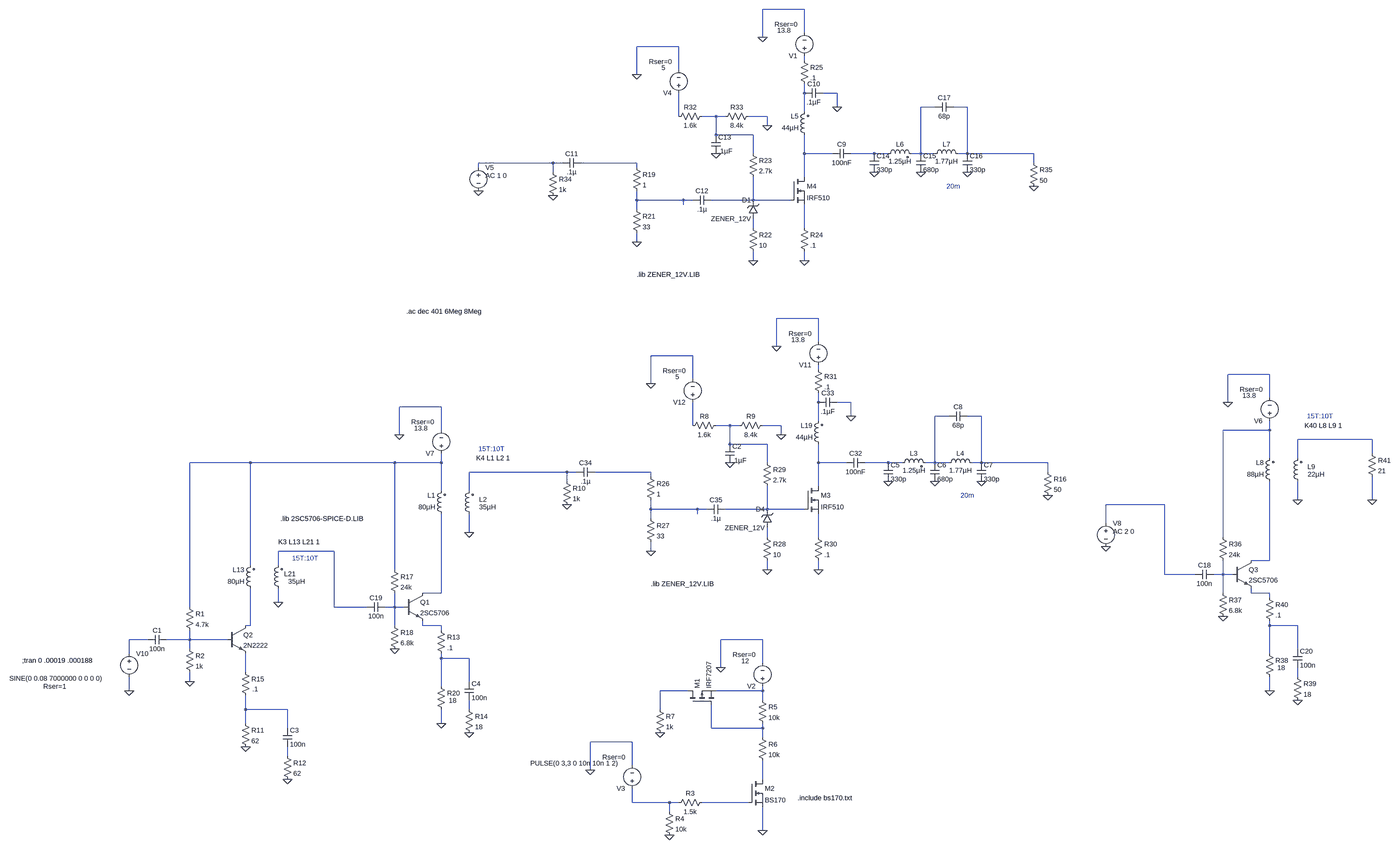
[diagram p0: schematic SSB Amp 7 MHz v2 Impedance.asc, whole sheet]
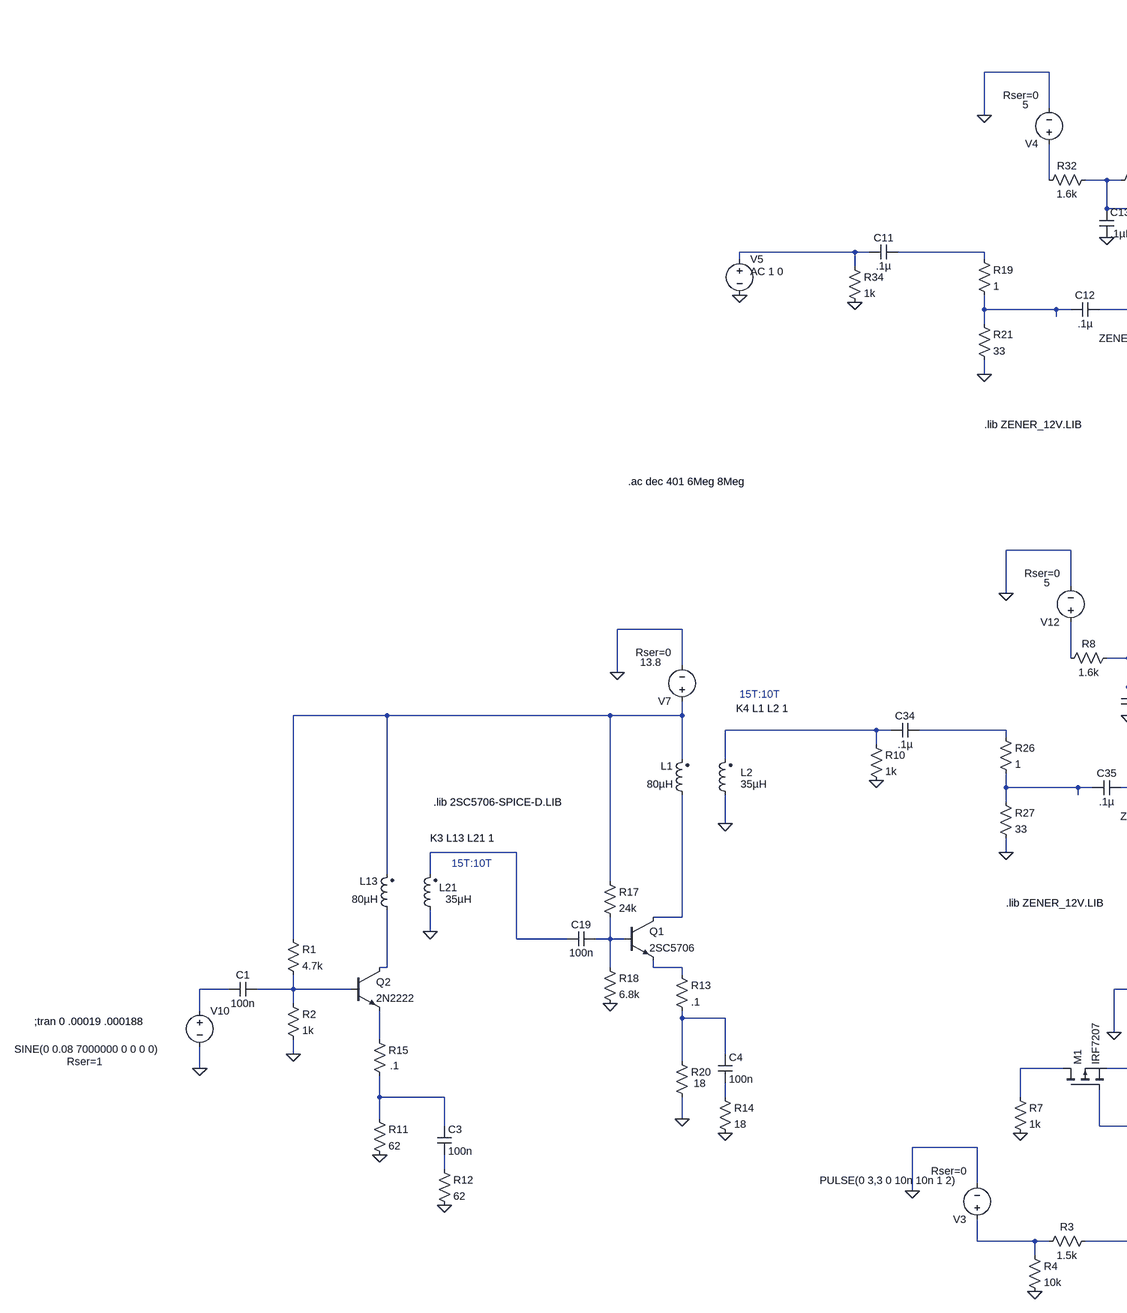
[diagram p1: schematic SSB Amp 7 MHz v2 Impedance.asc, part, row 1 of 1, column 1 of 2]
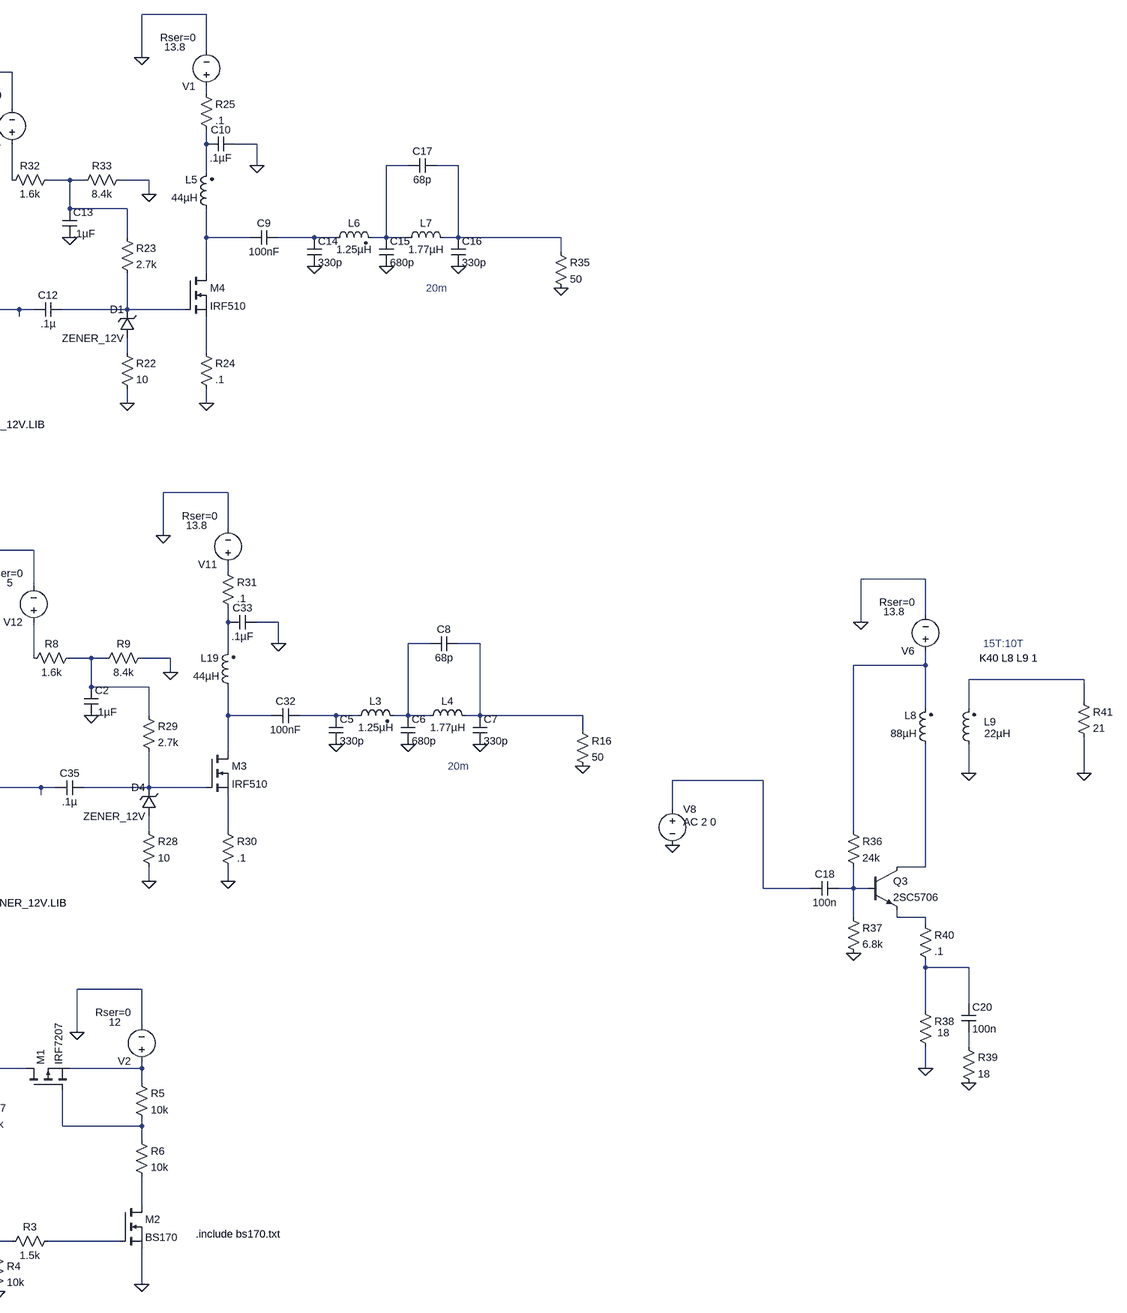
[diagram p2: schematic SSB Amp 7 MHz v2 Impedance.asc, part, row 1 of 1, column 2 of 2]
SSB Amp 7 MHz v2 Impedance.asc, the LTspice schematic file:
Version 4
SHEET 1 3764 1240
WIRE 560 -4608 416 -4608
WIRE 560 -4528 560 -4608
WIRE 416 -4512 416 -4608
WIRE 128 -4480 -16 -4480
WIRE 560 -4432 560 -4448
WIRE 128 -4400 128 -4480
WIRE -16 -4384 -16 -4480
WIRE 560 -4320 560 -4352
WIRE 672 -4320 624 -4320
WIRE 672 -4272 672 -4320
WIRE 1008 -4272 960 -4272
WIRE 1120 -4272 1072 -4272
WIRE 560 -4256 560 -4320
WIRE 128 -4240 128 -4320
WIRE 256 -4240 208 -4240
WIRE 288 -4240 256 -4240
WIRE 432 -4240 368 -4240
WIRE 432 -4208 432 -4240
WIRE 256 -4176 256 -4240
WIRE 384 -4176 256 -4176
WIRE 384 -4112 384 -4176
WIRE 560 -4112 560 -4176
WIRE 656 -4112 560 -4112
WIRE 800 -4112 720 -4112
WIRE 848 -4112 800 -4112
WIRE 960 -4112 960 -4272
WIRE 960 -4112 928 -4112
WIRE 1008 -4112 960 -4112
WIRE 1120 -4112 1120 -4272
WIRE 1120 -4112 1088 -4112
WIRE 1488 -4112 1120 -4112
WIRE -304 -4080 -560 -4080
WIRE -272 -4080 -304 -4080
WIRE -16 -4080 -208 -4080
WIRE 1488 -4080 1488 -4112
WIRE -560 -4064 -560 -4080
WIRE -16 -4064 -16 -4080
WIRE -304 -4048 -304 -4080
WIRE 560 -4032 560 -4112
WIRE -16 -3952 -16 -3984
WIRE 144 -3952 -16 -3952
WIRE 176 -3952 144 -3952
WIRE 384 -3952 384 -4032
WIRE 384 -3952 240 -3952
WIRE 512 -3952 384 -3952
WIRE 144 -3936 144 -3952
WIRE -16 -3920 -16 -3952
WIRE 384 -3856 384 -3888
WIRE 560 -3856 560 -3936
WIRE -16 -3808 -16 -3840
WIRE 384 -3744 384 -3776
WIRE 560 -3744 560 -3776
WIRE 608 -3472 464 -3472
WIRE 608 -3392 608 -3472
WIRE 464 -3376 464 -3472
WIRE 176 -3344 32 -3344
WIRE 608 -3296 608 -3312
WIRE 3200 -3280 3056 -3280
WIRE 176 -3264 176 -3344
WIRE 32 -3248 32 -3344
WIRE 3200 -3200 3200 -3280
WIRE 608 -3184 608 -3216
WIRE 720 -3184 672 -3184
WIRE 3056 -3184 3056 -3280
WIRE -688 -3168 -832 -3168
WIRE 720 -3136 720 -3184
WIRE 1056 -3136 1008 -3136
WIRE 1168 -3136 1120 -3136
WIRE 608 -3120 608 -3184
WIRE 176 -3104 176 -3184
WIRE 304 -3104 256 -3104
WIRE 336 -3104 304 -3104
WIRE 480 -3104 416 -3104
WIRE -688 -3088 -688 -3168
WIRE 3200 -3088 3200 -3120
WIRE 3200 -3088 3040 -3088
WIRE -832 -3072 -832 -3168
WIRE 480 -3072 480 -3104
WIRE 3552 -3056 3296 -3056
WIRE 304 -3040 304 -3104
WIRE 432 -3040 304 -3040
WIRE 3552 -3008 3552 -3056
WIRE 3200 -2992 3200 -3088
WIRE 3296 -2992 3296 -3056
WIRE -1344 -2976 -1552 -2976
WIRE -848 -2976 -1344 -2976
WIRE -688 -2976 -688 -3008
WIRE -688 -2976 -848 -2976
WIRE 432 -2976 432 -3040
WIRE 608 -2976 608 -3040
WIRE 704 -2976 608 -2976
WIRE 848 -2976 768 -2976
WIRE 896 -2976 848 -2976
WIRE 1008 -2976 1008 -3136
WIRE 1008 -2976 976 -2976
WIRE 1056 -2976 1008 -2976
WIRE 1168 -2976 1168 -3136
WIRE 1168 -2976 1136 -2976
WIRE 1536 -2976 1168 -2976
WIRE -256 -2944 -592 -2944
WIRE -224 -2944 -256 -2944
WIRE 32 -2944 -160 -2944
WIRE 1536 -2944 1536 -2976
WIRE 32 -2928 32 -2944
WIRE -256 -2912 -256 -2944
WIRE 608 -2896 608 -2976
WIRE -688 -2880 -688 -2976
WIRE -592 -2880 -592 -2944
WIRE 3296 -2848 3296 -2912
WIRE 3552 -2848 3552 -2928
WIRE 2832 -2832 2544 -2832
WIRE 32 -2816 32 -2848
WIRE 192 -2816 32 -2816
WIRE 224 -2816 192 -2816
WIRE 432 -2816 432 -2896
WIRE 432 -2816 288 -2816
WIRE 560 -2816 432 -2816
WIRE 192 -2800 192 -2816
WIRE 32 -2784 32 -2816
WIRE 2544 -2768 2544 -2832
WIRE -592 -2736 -592 -2800
WIRE 432 -2720 432 -2752
WIRE 608 -2720 608 -2800
WIRE 3040 -2720 3040 -3088
WIRE -1056 -2672 -1248 -2672
WIRE 32 -2672 32 -2704
WIRE 3200 -2640 3200 -2912
WIRE 3200 -2640 3136 -2640
WIRE -1344 -2624 -1344 -2976
WIRE -1248 -2624 -1248 -2672
WIRE -848 -2608 -848 -2976
WIRE 432 -2608 432 -2640
WIRE 608 -2608 608 -2640
WIRE 2832 -2592 2832 -2832
WIRE 2944 -2592 2832 -2592
WIRE 3040 -2592 3040 -2640
WIRE 3040 -2592 3008 -2592
WIRE 3072 -2592 3040 -2592
WIRE -688 -2528 -688 -2800
WIRE -688 -2528 -752 -2528
WIRE 3040 -2528 3040 -2592
WIRE 3136 -2528 3136 -2544
WIRE 3200 -2528 3136 -2528
WIRE 3200 -2512 3200 -2528
WIRE -1248 -2496 -1248 -2544
WIRE -1552 -2480 -1552 -2976
WIRE -1056 -2480 -1056 -2672
WIRE -944 -2480 -1056 -2480
WIRE -848 -2480 -848 -2528
WIRE -848 -2480 -880 -2480
WIRE -816 -2480 -848 -2480
WIRE -1344 -2416 -1344 -2544
WIRE -1344 -2416 -1360 -2416
WIRE -848 -2416 -848 -2480
WIRE -752 -2416 -752 -2432
WIRE -688 -2416 -752 -2416
WIRE 3200 -2416 3200 -2432
WIRE 3296 -2416 3200 -2416
WIRE -688 -2400 -688 -2416
WIRE -1696 -2368 -1760 -2368
WIRE -1552 -2368 -1552 -2400
WIRE -1552 -2368 -1632 -2368
WIRE -1424 -2368 -1552 -2368
WIRE 416 -2368 272 -2368
WIRE -1552 -2336 -1552 -2368
WIRE 3296 -2336 3296 -2416
WIRE -1760 -2320 -1760 -2368
WIRE 3200 -2320 3200 -2416
WIRE -688 -2304 -688 -2320
WIRE -592 -2304 -688 -2304
WIRE 416 -2288 416 -2368
WIRE 272 -2272 272 -2368
WIRE -1360 -2256 -1360 -2320
WIRE 3296 -2240 3296 -2272
WIRE -1552 -2224 -1552 -2256
WIRE -592 -2224 -592 -2304
WIRE -688 -2208 -688 -2304
WIRE -1760 -2192 -1760 -2240
WIRE 160 -2192 64 -2192
WIRE 416 -2192 416 -2208
WIRE 416 -2192 256 -2192
WIRE 3200 -2192 3200 -2240
WIRE 416 -2160 416 -2192
WIRE -1360 -2128 -1360 -2176
WIRE -1216 -2128 -1360 -2128
WIRE -592 -2128 -592 -2160
WIRE 64 -2128 64 -2192
WIRE -1360 -2080 -1360 -2128
WIRE -688 -2080 -688 -2128
WIRE -1216 -2064 -1216 -2128
WIRE 240 -2064 240 -2144
WIRE 416 -2064 416 -2080
WIRE 416 -2064 240 -2064
WIRE 416 -2032 416 -2064
WIRE -32 -2016 -176 -2016
WIRE -1216 -1968 -1216 -2000
WIRE -32 -1936 -32 -2016
WIRE -176 -1920 -176 -2016
WIRE 416 -1888 416 -1952
WIRE -32 -1808 -32 -1856
WIRE 96 -1808 -32 -1808
WIRE 128 -1808 96 -1808
WIRE 368 -1808 208 -1808
WIRE 96 -1776 96 -1808
WIRE 416 -1712 416 -1792
FLAG -832 -3072 0
FLAG -848 -2336 0
FLAG -688 -2080 0
FLAG -1760 -2192 0
FLAG 464 -3376 0
FLAG 720 -3136 0
FLAG 32 -2672 0
FLAG 432 -2608 0
FLAG 608 -2608 0
FLAG 32 -3248 0
FLAG -1552 -2224 0
FLAG 416 -1712 0
FLAG 96 -1696 0
FLAG 272 -2272 0
FLAG -176 -1920 0
FLAG 64 -2048 0
FLAG 480 -3072 0
FLAG 304 -2976 0
FLAG -256 -2832 0
FLAG -1360 -2000 0
FLAG -1216 -1888 0
FLAG -1248 -2496 0
FLAG -592 -2048 0
FLAG -592 -2736 0
FLAG 1536 -2864 0
FLAG 848 -2912 0
FLAG 1008 -2912 0
FLAG 1168 -2912 0
FLAG 416 -4512 0
FLAG 672 -4272 0
FLAG -16 -3808 0
FLAG 384 -3744 0
FLAG 560 -3744 0
FLAG -16 -4384 0
FLAG 432 -4208 0
FLAG 256 -4112 0
FLAG -304 -3968 0
FLAG 1488 -4000 0
FLAG 800 -4048 0
FLAG 960 -4048 0
FLAG 1120 -4048 0
FLAG -560 -3984 0
FLAG 3056 -3184 0
FLAG 3040 -2448 0
FLAG 3200 -2192 0
FLAG 3296 -2160 0
FLAG 3296 -2848 0
FLAG 2544 -2688 0
FLAG 3552 -2848 0
SYMBOL npn -816 -2528 R0
SYMATTR InstName Q1
SYMATTR Value 2SC5706
SYMBOL voltage -688 -2992 R180
WINDOW 123 0 0 Left 0
WINDOW 39 24 124 Left 2
WINDOW 3 46 103 Left 2
SYMATTR SpiceLine Rser=0
SYMATTR Value 13.8
SYMATTR InstName V7
SYMBOL npn -1424 -2416 R0
SYMATTR InstName Q2
SYMATTR Value 2N2222
SYMBOL cap -880 -2496 R90
WINDOW 0 0 32 VBottom 2
WINDOW 3 32 32 VTop 2
SYMATTR InstName C19
SYMATTR Value 100n
SYMBOL res -864 -2624 R0
SYMATTR InstName R17
SYMATTR Value 24k
SYMBOL res -864 -2432 R0
SYMATTR InstName R18
SYMATTR Value 6.8k
SYMBOL ind2 -1328 -2528 R180
WINDOW 0 36 80 Left 2
WINDOW 3 36 40 Left 2
SYMATTR InstName L13
SYMATTR Value 80µH
SYMATTR Type ind
SYMBOL res -704 -2224 R0
WINDOW 3 42 65 Left 2
SYMATTR Value 18
SYMATTR InstName R20
SYMBOL voltage -1760 -2336 R0
WINDOW 123 0 0 Left 0
WINDOW 39 -295 129 Left 2
WINDOW 3 -412 101 Left 2
SYMATTR SpiceLine Rser=1
SYMATTR Value SINE(0 0.08 7000000 0 0 0 0)
SYMATTR InstName V10
SYMBOL voltage 608 -3296 R180
WINDOW 123 0 0 Left 0
WINDOW 39 24 124 Left 2
WINDOW 3 46 103 Left 2
SYMATTR SpiceLine Rser=0
SYMATTR Value 13.8
SYMATTR InstName V11
SYMBOL ind2 624 -3024 R180
WINDOW 0 36 80 Left 2
WINDOW 3 36 40 Left 2
SYMATTR InstName L19
SYMATTR Value 44µH
SYMATTR Type ind
SYMBOL cap 768 -2992 R90
WINDOW 0 0 32 VBottom 2
WINDOW 3 32 32 VTop 2
SYMATTR InstName C32
SYMATTR Value 100nF
SYMBOL ind2 -1232 -2528 R180
WINDOW 0 -45 66 Left 2
WINDOW 3 -76 40 Left 2
SYMATTR InstName L21
SYMATTR Value 35µH
SYMATTR Type ind
SYMBOL cap 672 -3200 R90
WINDOW 0 0 32 VBottom 2
WINDOW 3 32 32 VTop 2
SYMATTR InstName C33
SYMATTR Value .1µF
SYMBOL cap -160 -2960 R90
WINDOW 0 0 32 VBottom 2
WINDOW 3 32 32 VTop 2
SYMATTR InstName C34
SYMATTR Value .1µ
SYMBOL zener 448 -2752 R180
WINDOW 0 24 64 Left 2
WINDOW 3 24 0 Left 2
SYMATTR InstName D4
SYMATTR Value ZENER_12V
SYMBOL res 16 -2944 R0
SYMATTR InstName R26
SYMATTR Value 1
SYMBOL res 16 -2800 R0
SYMATTR InstName R27
SYMATTR Value 33
SYMBOL cap 288 -2832 R90
WINDOW 0 0 32 VBottom 2
WINDOW 3 32 32 VTop 2
SYMATTR InstName C35
SYMATTR Value .1µ
SYMBOL res 416 -2736 R0
SYMATTR InstName R28
SYMATTR Value 10
SYMBOL nmos 560 -2896 R0
SYMATTR InstName M3
SYMATTR Value IRF510
SYMBOL res 416 -2992 R0
SYMATTR InstName R29
SYMATTR Value 2.7k
SYMBOL voltage 176 -3168 R180
WINDOW 123 0 0 Left 0
WINDOW 39 24 124 Left 2
WINDOW 3 46 103 Left 2
SYMATTR SpiceLine Rser=0
SYMATTR Value 5
SYMATTR InstName V12
SYMBOL res 592 -2736 R0
SYMATTR InstName R30
SYMATTR Value .1
SYMBOL res 592 -3312 R0
SYMATTR InstName R31
SYMATTR Value .1
SYMBOL cap -1632 -2384 R90
WINDOW 0 0 32 VBottom 2
WINDOW 3 32 32 VTop 2
SYMATTR InstName C1
SYMATTR Value 100n
SYMBOL res -1568 -2496 R0
SYMATTR InstName R1
SYMATTR Value 4.7k
SYMBOL res -1568 -2352 R0
SYMATTR InstName R2
SYMATTR Value 1k
SYMBOL nmos 368 -1888 R0
SYMATTR InstName M2
SYMATTR Value BS170
SYMATTR Prefix X
SYMBOL res 224 -1824 R90
WINDOW 0 0 56 VBottom 2
WINDOW 3 32 56 VTop 2
SYMATTR InstName R3
SYMATTR Value 1.5k
SYMBOL res 80 -1792 R0
SYMATTR InstName R4
SYMATTR Value 10k
SYMBOL voltage 416 -2192 R180
WINDOW 123 0 0 Left 0
WINDOW 39 24 124 Left 2
WINDOW 3 46 103 Left 2
SYMATTR SpiceLine Rser=0
SYMATTR Value 12
SYMATTR InstName V2
SYMBOL res 400 -2176 R0
SYMATTR InstName R5
SYMATTR Value 10k
SYMBOL res 400 -2048 R0
SYMATTR InstName R6
SYMATTR Value 10k
SYMBOL voltage -32 -1840 R180
WINDOW 123 0 0 Left 0
WINDOW 39 24 124 Left 2
WINDOW 3 46 103 Left 2
SYMATTR SpiceLine Rser=0
SYMATTR Value PULSE(0 3,3 0 10n 10n 1 2)
SYMATTR InstName V3
SYMBOL pmos 160 -2144 R270
SYMATTR InstName M1
SYMATTR Value IRF7207
SYMBOL res 48 -2144 R0
SYMATTR InstName R7
SYMATTR Value 1k
SYMBOL res 272 -3120 R90
WINDOW 0 0 56 VBottom 2
WINDOW 3 32 56 VTop 2
SYMATTR InstName R8
SYMATTR Value 1.6k
SYMBOL res 432 -3120 R90
WINDOW 0 0 56 VBottom 2
WINDOW 3 32 56 VTop 2
SYMATTR InstName R9
SYMATTR Value 8.4k
SYMBOL res -272 -2928 R0
SYMATTR InstName R10
SYMATTR Value 1k
SYMBOL cap 288 -3040 R0
SYMATTR InstName C2
SYMATTR Value .1µF
SYMBOL res -1376 -2096 R0
SYMATTR InstName R11
SYMATTR Value 62
SYMBOL res -1232 -1984 R0
SYMATTR InstName R12
SYMATTR Value 62
SYMBOL cap -1232 -2064 R0
SYMATTR InstName C3
SYMATTR Value 100n
SYMBOL res -608 -2144 R0
SYMATTR InstName R14
SYMATTR Value 18
SYMBOL cap -608 -2224 R0
SYMATTR InstName C4
SYMATTR Value 100n
SYMBOL ind2 -672 -2784 R180
WINDOW 0 36 80 Left 2
WINDOW 3 36 40 Left 2
SYMATTR InstName L1
SYMATTR Value 80µH
SYMATTR Type ind
SYMBOL ind2 -576 -2784 R180
WINDOW 0 -45 66 Left 2
WINDOW 3 -76 40 Left 2
SYMATTR InstName L2
SYMATTR Value 35µH
SYMATTR Type ind
SYMBOL res -704 -2416 R0
SYMATTR InstName R13
SYMATTR Value .1
SYMBOL res -1376 -2272 R0
WINDOW 3 39 74 Left 2
SYMATTR Value .1
SYMATTR InstName R15
SYMBOL res 1520 -2960 R0
SYMATTR InstName R16
SYMATTR Value 50
SYMBOL cap 832 -2976 R0
SYMATTR InstName C5
SYMATTR Value 330p
SYMBOL cap 992 -2976 R0
SYMATTR InstName C6
SYMATTR Value 680p
SYMBOL cap 1152 -2976 R0
SYMATTR InstName C7
SYMATTR Value 330p
SYMBOL ind2 880 -2960 R270
WINDOW 0 32 56 VTop 2
WINDOW 3 5 56 VBottom 2
SYMATTR InstName L3
SYMATTR Value 1.25µH
SYMATTR Type ind
SYMBOL ind 1040 -2960 R270
WINDOW 0 32 56 VTop 2
WINDOW 3 5 56 VBottom 2
SYMATTR InstName L4
SYMATTR Value 1.77µH
SYMBOL cap 1120 -3152 R90
WINDOW 0 0 32 VBottom 2
WINDOW 3 32 32 VTop 2
SYMATTR InstName C8
SYMATTR Value 68p
SYMBOL voltage 560 -4432 R180
WINDOW 123 0 0 Left 0
WINDOW 39 24 124 Left 2
WINDOW 3 46 103 Left 2
SYMATTR SpiceLine Rser=0
SYMATTR Value 13.8
SYMATTR InstName V1
SYMBOL ind2 576 -4160 R180
WINDOW 0 36 80 Left 2
WINDOW 3 36 40 Left 2
SYMATTR InstName L5
SYMATTR Value 44µH
SYMATTR Type ind
SYMBOL cap 720 -4128 R90
WINDOW 0 0 32 VBottom 2
WINDOW 3 32 32 VTop 2
SYMATTR InstName C9
SYMATTR Value 100nF
SYMBOL cap 624 -4336 R90
WINDOW 0 0 32 VBottom 2
WINDOW 3 32 32 VTop 2
SYMATTR InstName C10
SYMATTR Value .1µF
SYMBOL cap -208 -4096 R90
WINDOW 0 0 32 VBottom 2
WINDOW 3 32 32 VTop 2
SYMATTR InstName C11
SYMATTR Value .1µ
SYMBOL zener 400 -3888 R180
WINDOW 0 24 64 Left 2
WINDOW 3 24 0 Left 2
SYMATTR InstName D1
SYMATTR Value ZENER_12V
SYMBOL res -32 -4080 R0
SYMATTR InstName R19
SYMATTR Value 1
SYMBOL res -32 -3936 R0
SYMATTR InstName R21
SYMATTR Value 33
SYMBOL cap 240 -3968 R90
WINDOW 0 0 32 VBottom 2
WINDOW 3 32 32 VTop 2
SYMATTR InstName C12
SYMATTR Value .1µ
SYMBOL res 368 -3872 R0
SYMATTR InstName R22
SYMATTR Value 10
SYMBOL nmos 512 -4032 R0
SYMATTR InstName M4
SYMATTR Value IRF510
SYMBOL res 368 -4128 R0
SYMATTR InstName R23
SYMATTR Value 2.7k
SYMBOL voltage 128 -4304 R180
WINDOW 123 0 0 Left 0
WINDOW 39 24 124 Left 2
WINDOW 3 46 103 Left 2
SYMATTR SpiceLine Rser=0
SYMATTR Value 5
SYMATTR InstName V4
SYMBOL res 544 -3872 R0
SYMATTR InstName R24
SYMATTR Value .1
SYMBOL res 544 -4448 R0
SYMATTR InstName R25
SYMATTR Value .1
SYMBOL res 224 -4256 R90
WINDOW 0 0 56 VBottom 2
WINDOW 3 32 56 VTop 2
SYMATTR InstName R32
SYMATTR Value 1.6k
SYMBOL res 384 -4256 R90
WINDOW 0 0 56 VBottom 2
WINDOW 3 32 56 VTop 2
SYMATTR InstName R33
SYMATTR Value 8.4k
SYMBOL res -320 -4064 R0
SYMATTR InstName R34
SYMATTR Value 1k
SYMBOL cap 240 -4176 R0
SYMATTR InstName C13
SYMATTR Value .1µF
SYMBOL res 1472 -4096 R0
SYMATTR InstName R35
SYMATTR Value 50
SYMBOL cap 784 -4112 R0
SYMATTR InstName C14
SYMATTR Value 330p
SYMBOL cap 944 -4112 R0
SYMATTR InstName C15
SYMATTR Value 680p
SYMBOL cap 1104 -4112 R0
SYMATTR InstName C16
SYMATTR Value 330p
SYMBOL ind2 832 -4096 R270
WINDOW 0 32 56 VTop 2
WINDOW 3 5 56 VBottom 2
SYMATTR InstName L6
SYMATTR Value 1.25µH
SYMATTR Type ind
SYMBOL ind 992 -4096 R270
WINDOW 0 32 56 VTop 2
WINDOW 3 5 56 VBottom 2
SYMATTR InstName L7
SYMATTR Value 1.77µH
SYMBOL cap 1072 -4288 R90
WINDOW 0 0 32 VBottom 2
WINDOW 3 32 32 VTop 2
SYMATTR InstName C17
SYMATTR Value 68p
SYMBOL voltage -560 -4080 R0
WINDOW 123 24 44 Left 2
WINDOW 39 0 0 Left 0
SYMATTR Value2 AC 1 0
SYMATTR InstName V5
SYMATTR Value ""
SYMBOL npn 3072 -2640 R0
SYMATTR InstName Q3
SYMATTR Value 2SC5706
SYMBOL voltage 3200 -3104 R180
WINDOW 123 0 0 Left 0
WINDOW 39 24 124 Left 2
WINDOW 3 46 103 Left 2
SYMATTR SpiceLine Rser=0
SYMATTR Value 13.8
SYMATTR InstName V6
SYMBOL cap 3008 -2608 R90
WINDOW 0 0 32 VBottom 2
WINDOW 3 32 32 VTop 2
SYMATTR InstName C18
SYMATTR Value 100n
SYMBOL res 3024 -2736 R0
SYMATTR InstName R36
SYMATTR Value 24k
SYMBOL res 3024 -2544 R0
SYMATTR InstName R37
SYMATTR Value 6.8k
SYMBOL res 3184 -2336 R0
WINDOW 3 42 65 Left 2
SYMATTR Value 18
SYMATTR InstName R38
SYMBOL res 3280 -2256 R0
SYMATTR InstName R39
SYMATTR Value 18
SYMBOL cap 3280 -2336 R0
SYMATTR InstName C20
SYMATTR Value 100n
SYMBOL ind2 3216 -2896 R180
WINDOW 0 36 80 Left 2
WINDOW 3 36 40 Left 2
SYMATTR InstName L8
SYMATTR Value 88µH
SYMATTR Type ind
SYMBOL ind2 3312 -2896 R180
WINDOW 0 -45 66 Left 2
WINDOW 3 -76 40 Left 2
SYMATTR InstName L9
SYMATTR Value 22µH
SYMATTR Type ind
SYMBOL res 3184 -2528 R0
SYMATTR InstName R40
SYMATTR Value .1
SYMBOL voltage 2544 -2784 R0
WINDOW 123 24 44 Left 2
WINDOW 39 0 0 Left 0
SYMATTR Value2 AC 2 0
SYMATTR InstName V8
SYMATTR Value ""
SYMBOL res 3536 -3024 R0
SYMATTR InstName R41
SYMATTR Value 21
TEXT -1240 -2784 Left 2 !.lib 2SC5706-SPICE-D.LIB
TEXT -568 -2992 Left 2 !K4 L1 L2 1
TEXT -2128 -2296 Left 2 !;tran 0 .00019 .000188
TEXT 536 -1824 Left 2 !.include bs170.txt
TEXT -1248 -2704 Left 2 !K3 L13 L21 1
TEXT 32 -2560 Left 2 !.lib ZENER_12V.LIB
TEXT 1096 -2864 Left 2 ;20m
TEXT -1200 -2648 Left 2 ;15T:10T
TEXT -560 -3024 Left 2 ;15T:10T
TEXT -16 -3696 Left 2 !.lib ZENER_12V.LIB
TEXT 1048 -4000 Left 2 ;20m
TEXT -808 -3496 Left 2 !.ac dec 401 6Meg 8Meg
TEXT 3320 -3104 Left 2 !K40 L8 L9 1
TEXT 3328 -3136 Left 2 ;15T:10T

The netlist it stands for:
* SSB Amp 7 MHz v2 Impedance.asc
Q1 N036 N038 N040 0 2SC5706
V7 N023 0 13.8 Rser=0
Q2 N039 N043 N045 0 2N2222
C19 N038 N033 100n
R17 N023 N038 24k
R18 N038 0 6.8k
L13 N039 N023 80µH
R20 N044 0 18
V10 N042 0 SINE(0 0.08 7000000 0 0 0 0) Rser=1
V11 N015 0 13.8 Rser=0
L19 N024 N016 44µH
C32 N025 N024 100nF
L21 0 N033 35µH
C33 0 N016 .1µF
C34 N027 N026 .1µ
D4 N031 N030 ZENER_12V
R26 N027 N029 1
R27 N029 0 33
C35 N030 N029 .1µ
R28 N031 0 10
M3 N024 N030 N032 N032 IRF510
R29 N020 N030 2.7k
V12 N019 0 5 Rser=0
R30 N032 0 .1
R31 N015 N016 .1
C1 N043 N042 100n
R1 N023 N043 4.7k
R2 N043 0 1k
XM2 N053 N055 0 BS170  ; pins D G S
R3 N055 N054 1.5k
R4 N054 0 10k
V2 N048 0 12 Rser=0
R5 N048 N051 10k
R6 N051 N053 10k
V3 N054 0 PULSE(0 3,3 0 10n 10n 1 2) Rser=0
M1 N047 N051 N048 N048 IRF7207
R7 N047 0 1k
R8 N020 N019 1.6k
R9 0 N020 8.4k
R10 N026 0 1k
C2 N020 0 .1µF
R11 N049 0 62
R12 N052 0 62
C3 N049 N052 100n
R14 N050 0 18
C4 N044 N050 100n
L1 N036 N023 80µH
L2 0 N026 35µH
R13 N040 N044 .1
R15 N045 N049 .1
R16 N018 0 50
C5 N025 0 330p
C6 N017 0 680p
C7 N018 0 330p
L3 N025 N017 1.25µH
L4 N017 N018 1.77µH
C8 N018 N017 68p
V1 N001 0 13.8 Rser=0
L5 N007 N002 44µH
C9 N008 N007 100nF
C10 0 N002 .1µF
C11 N010 N009 .1µ
D1 N013 N012 ZENER_12V
R19 N010 N011 1
R21 N011 0 33
C12 N012 N011 .1µ
R22 N013 0 10
M4 N007 N012 N014 N014 IRF510
R23 N006 N012 2.7k
V4 N005 0 5 Rser=0
R24 N014 0 .1
R25 N001 N002 .1
R32 N006 N005 1.6k
R33 0 N006 8.4k
R34 N009 0 1k
C13 N006 0 .1µF
R35 N004 0 50
C14 N008 0 330p
C15 N003 0 680p
C16 N004 0 330p
L6 N008 N003 1.25µH
L7 N003 N004 1.77µH
C17 N004 N003 68p
V5 N009 0 AC 1 0
Q3 N034 N035 N037 0 2SC5706
V6 N021 0 13.8 Rser=0
C18 N035 N028 100n
R36 N021 N035 24k
R37 N035 0 6.8k
R38 N041 0 18
R39 N046 0 18
C20 N041 N046 100n
L8 N034 N021 88µH
L9 0 N022 22µH
R40 N037 N041 .1
V8 N028 0 AC 2 0
R41 N022 0 21
.model D D
.lib standard.dio
.model NPN NPN
.model PNP PNP
.lib standard.bjt
.model NMOS NMOS
.model PMOS PMOS
.lib standard.mos
.lib 2SC5706-SPICE-D.LIB
K4 L1 L2 1
;tran 0 .00019 .000188
.include bs170.txt
K3 L13 L21 1
.lib ZENER_12V.LIB
* 20m
* 15T:10T
* 15T:10T
.lib ZENER_12V.LIB
* 20m
.ac dec 401 6Meg 8Meg
K40 L8 L9 1
* 15T:10T
.backanno
.end